# EAGLE design EEZ DIB module template (non-isolated) (EAGLE 7.2.0)
Assembly variants: Farnell, TME
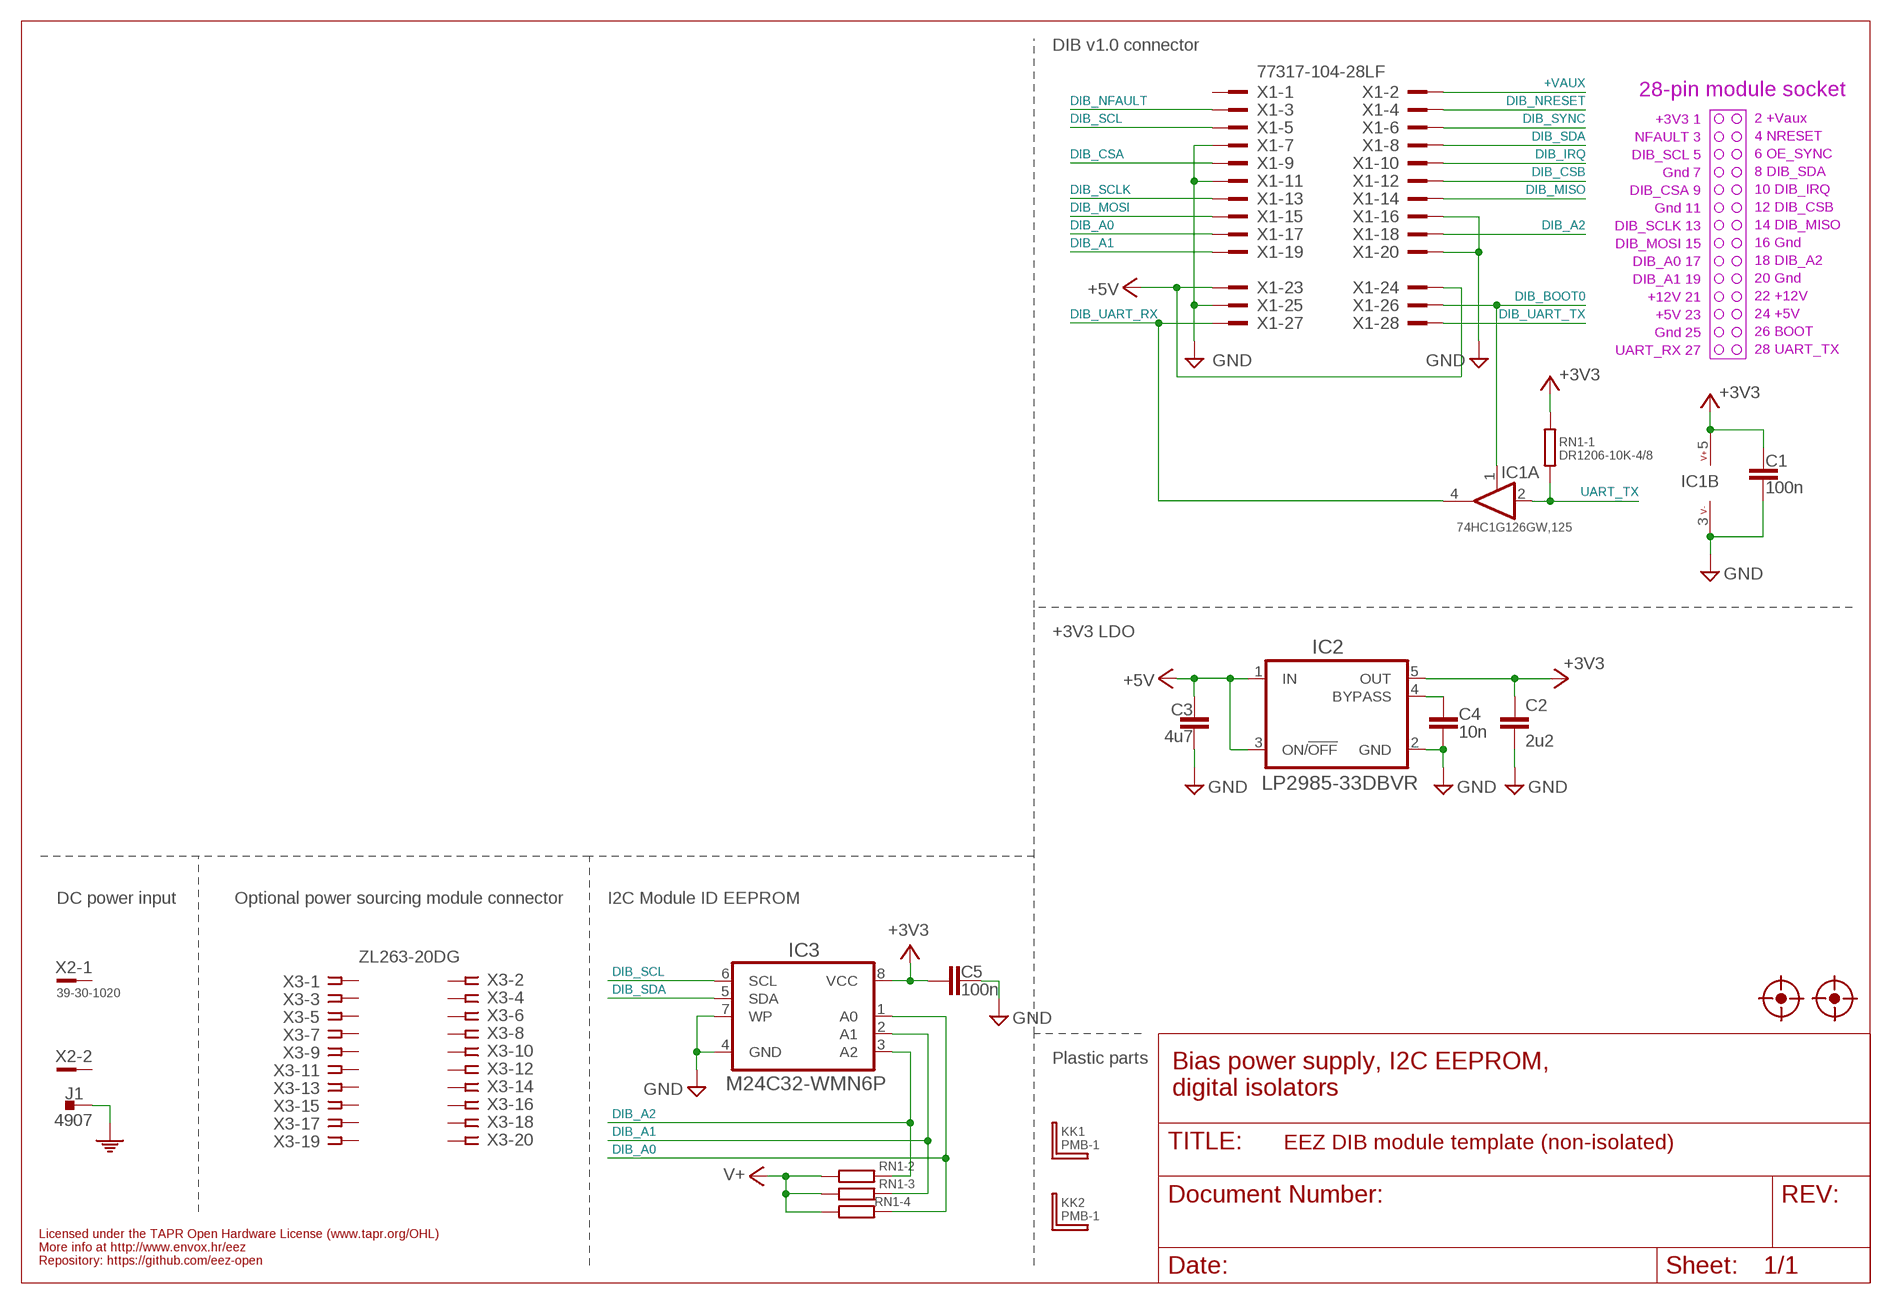
[diagram p0: schematic, sheet 1]

## Parts
C1  100n  C-EUC0603  [C0603]
C2  2u2  C-EUC0805  [C0805]
C3  4u7  C-EUC0805  [C0805]
C4  10n  C-EUC0805  [C0805]
C5  100n  C-EUC0603  [C0603]
FM1  FIDUCIAL_2  [FIDUCIAL_DUAL]
FM2  FIDUCIAL_2  [FIDUCIAL_DUAL]
IC1  74HC1G126GW,125  [SOT65P210X110-5N]
IC2  LP2985-33DBVR  LP2985  [SOT95P270X145-5N]
IC3  M24C32-WMN6P  AT24CXXSOIC8  [SOIC127P600X173-8N]
J1  4907  PCB_TAB-4907  [PCB_TAB-4907]
KK1  PMB-1  PCB-MB  [PCB-MB]
KK2  PMB-1  PCB-MB  [PCB-MB]
RN1  DR1206-10K-4/8  R_ARRAY4  [CAY16]
X1  77317-104-28LF  [77317-104-28LF]
X2  39-30-1020  MINIFIT_39301020  [MINIFIT_39301020]
X3  ZL263-20DG  SSW-110-02-T-D-RA  [SSW-110-02-T-D-RA]

## Nets
+3V3: C1.1 C2.1 C5.2 IC1.5(B:V+) IC2.5(OUT) IC3.8(VCC) RN1.8
+5V: C3.2 IC2.1(IN) IC2.3(ON/!OFF) X1.23 X1.24
+VAUX: X1.2
DIB_A0: IC3.1(A0) RN1.4 X1.17
DIB_A1: IC3.2(A1) RN1.3 X1.19
DIB_A2: IC3.3(A2) RN1.2 X1.18
DIB_BOOT0: IC1.1(A:EN) X1.26
DIB_CSA: X1.9
DIB_CSB: X1.12
DIB_IRQ: X1.10
DIB_MISO: X1.14
DIB_MOSI: X1.15
DIB_NFAULT: X1.3
DIB_NRESET: X1.4
DIB_SCL: IC3.6(SCL) X1.5
DIB_SCLK: X1.13
DIB_SDA: IC3.5(SDA) X1.8
DIB_SYNC: X1.6
DIB_UART_RX: IC1.4(A:O) X1.27
DIB_UART_TX: X1.28
GND: C1.2 C2.2 C3.1 C4.1 C5.1 IC1.3(B:V-) IC2.2(GND) IC3.4(GND) IC3.7(WP) X1.7 X1.11 X1.16 X1.20 X1.25
N$1: C4.2 IC2.4(BYPASS)
PE: J1.1 J1.2
UART_TX: IC1.2(A:I) RN1.1
V+: RN1.5 RN1.6 RN1.7
Unconnected: X1.1 X1.21 X1.22 X2.1 X2.2 X3.1 X3.2 X3.3 X3.4 X3.5 X3.6 X3.7 X3.8 X3.9 X3.10 X3.11 X3.12 X3.13 X3.14 X3.15 X3.16 X3.17 X3.18 X3.19 X3.20

## Notes on the sheet
- DIB v1.0 connector
- 28-pin module socket
- +3V3 1
- 2 +Vaux
- NFAULT 3
- 4 NRESET
- DIB_SCL 5
- 6 OE_SYNC
- Gnd 7
- 8 DIB_SDA
- DIB_CSA 9
- 10 DIB_IRQ
- Gnd 11
- 12 DIB_CSB
- DIB_SCLK 13
- 14 DIB_MISO
- DIB_MOSI 15
- 16 Gnd
- DIB_A0 17
- 18 DIB_A2
- DIB_A1 19
- 20 Gnd
- +12V 21
- 22 +12V
- +5V 23
- 24 +5V
- Gnd 25
- 26 BOOT
- UART_RX 27
- 28 UART_TX
- +3V3 LDO
- DC power input | Optional power sourcing module connector | I2C Module ID EEPROM
- Plastic parts
- Bias power supply, I2C EEPROM,
  digital isolators
- Licensed under the TAPR Open Hardware License (www.tapr.org/OHL)
- More info at http://www.envox.hr/eez
- Repository: https://github.com/eez-open

## Library data of the parts
C1-C5 = rcl:C-EU: CAPACITOR, European symbol
FM1 FM2 = EEZ_Lib1:FIDUCIAL: Fiducial mark for pick and place automation
IC1 = EEZ_Lib1:74HC1G126: Single Bus Buffer Gate With 3-State Outputs
IC2 = EEZ_DIB:LP2985: 150-mA Low-noise Low-dropout Regulator With Shutdown
IC3 = EEZ_Lib1:AT24CXX: I2C-Compatible (2-wire) Serial EEPROM
J1 = EEZ_connectors:PCB_TAB: PCB quick-fit terminal
KK1 KK2 = EEZ_Lib1:PCB-MB: Richo Mounting Block; 16 x 6 mm
RN1 = EEZ_Lib1:R_ARRAY4: 1206 four resistor array
X1 = EEZ_connectors:77317-104-28LF: Headers & Wire Housings 28P right angle 0.1" pitch
X2 = EEZ_connectors:MINIFIT_39301020: Molex Socket; wire-board; male; Mini-Fit Jr; 4.2mm; PIN:2; THT; PCB snap
X3 = EEZ_connectors:SSW-110-02-T-D-RA: Samtec SSW-113-02-T-D-RA Receptacle, 2.54MM, RA, 20-way

## Net classes
0 default: width 0.203 mm, drill 0.3 mm, clearance 0.203 mm
1 lvds: width 0.152 mm, drill 0.3 mm, clearance 0.152 mm to class 0, clearance 0.152 mm
2 gnd: width 0.254 mm, drill 0.584 mm, clearance 0.254 mm

## Board
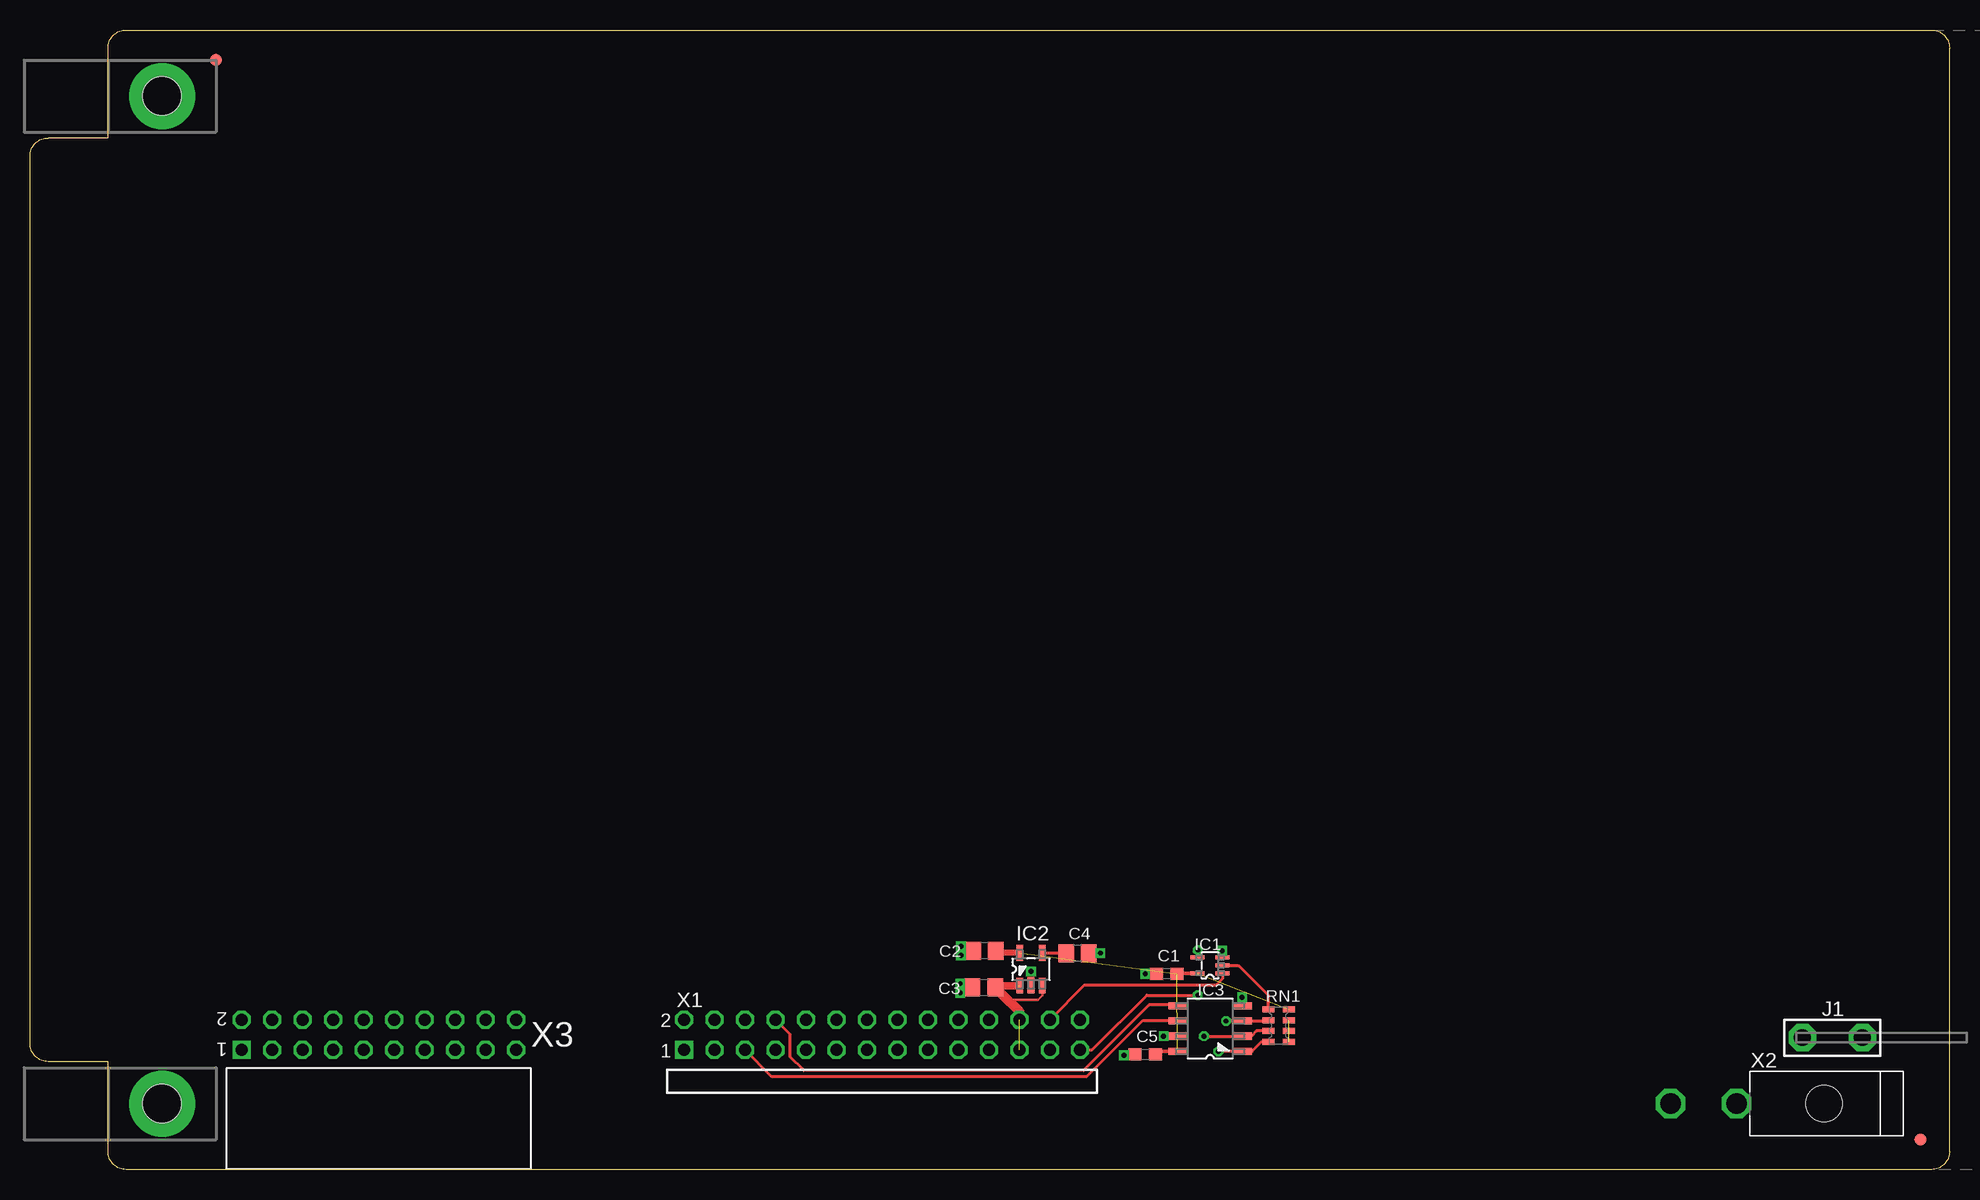
[diagram p1: board, top side]
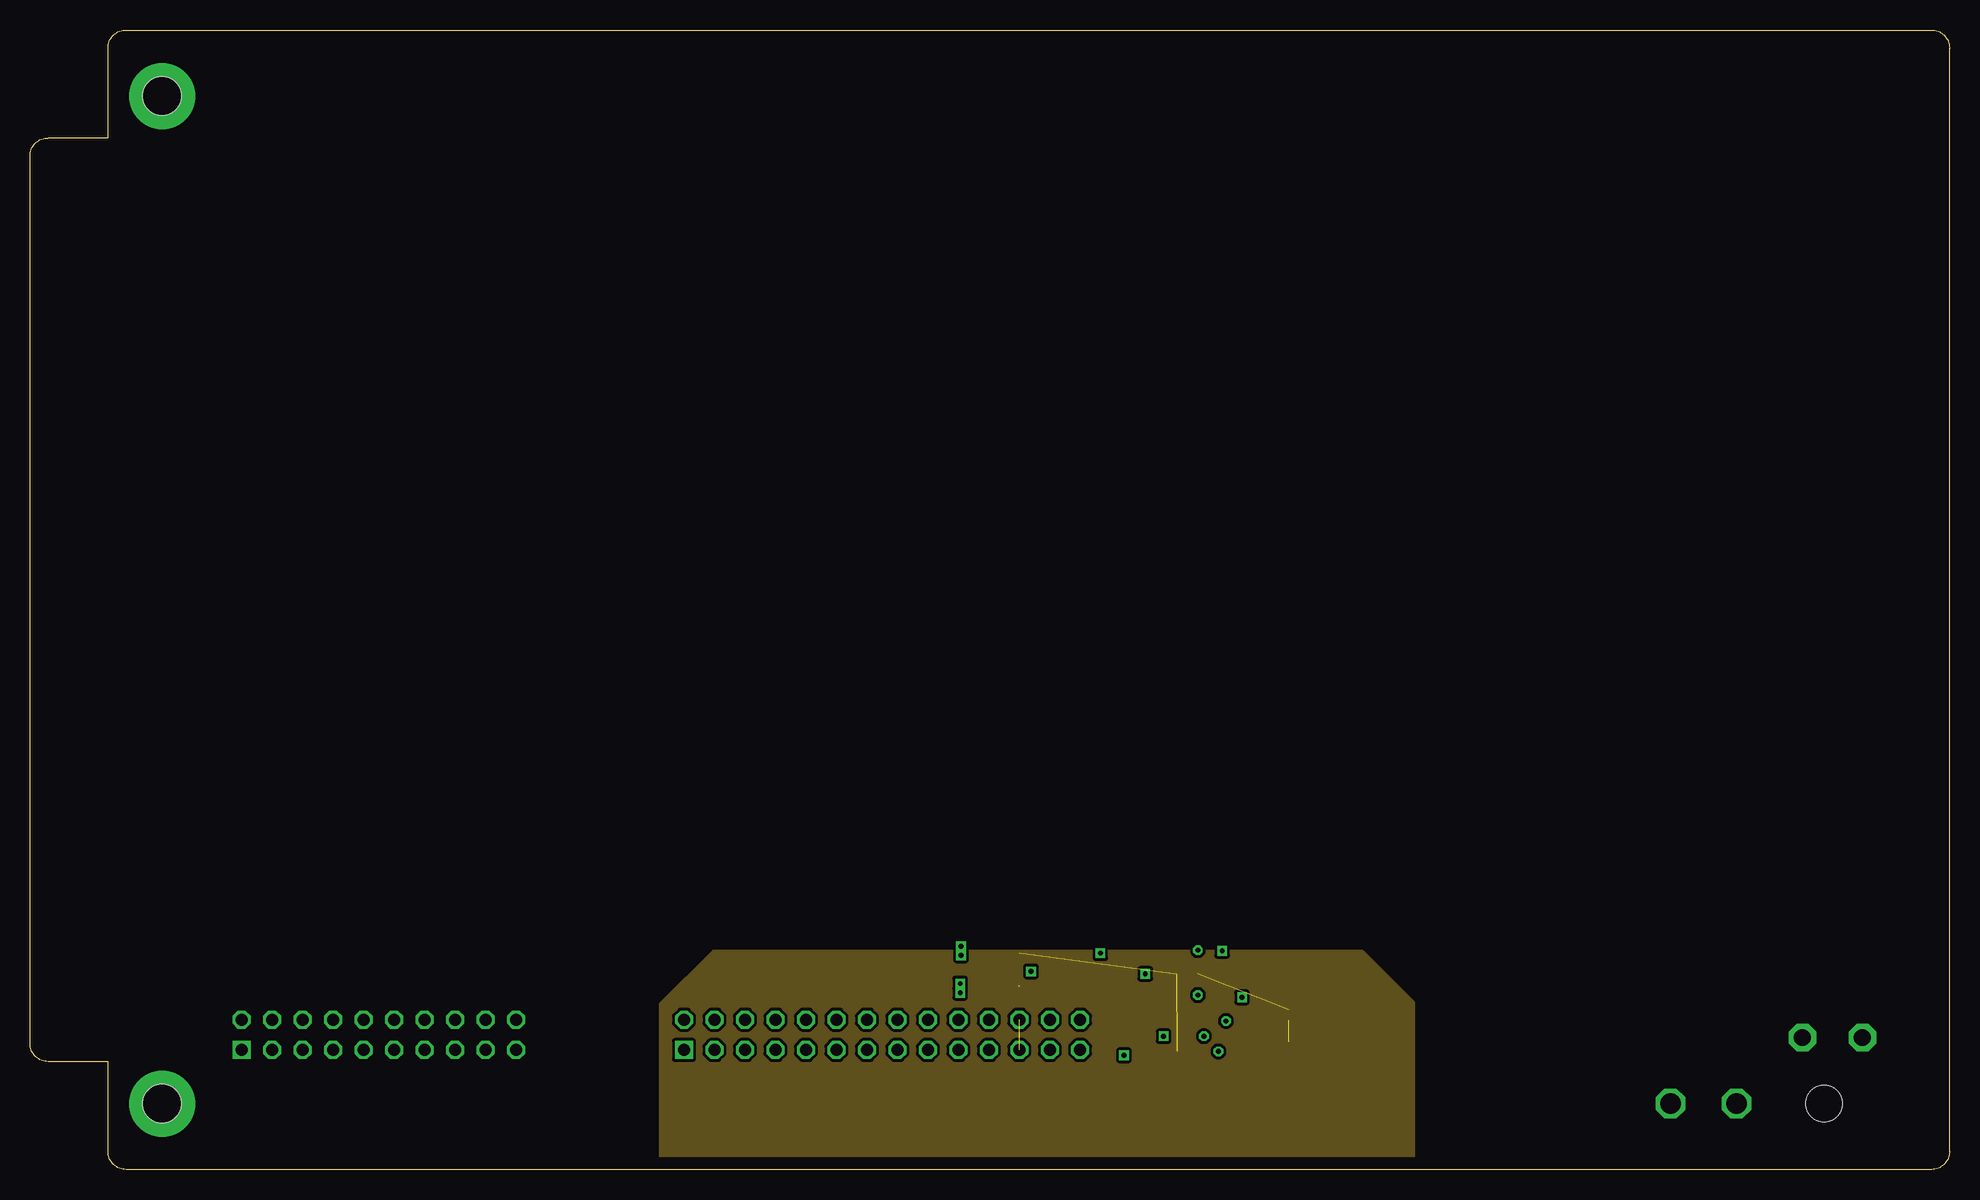
[diagram p2: board, inner layer L2]
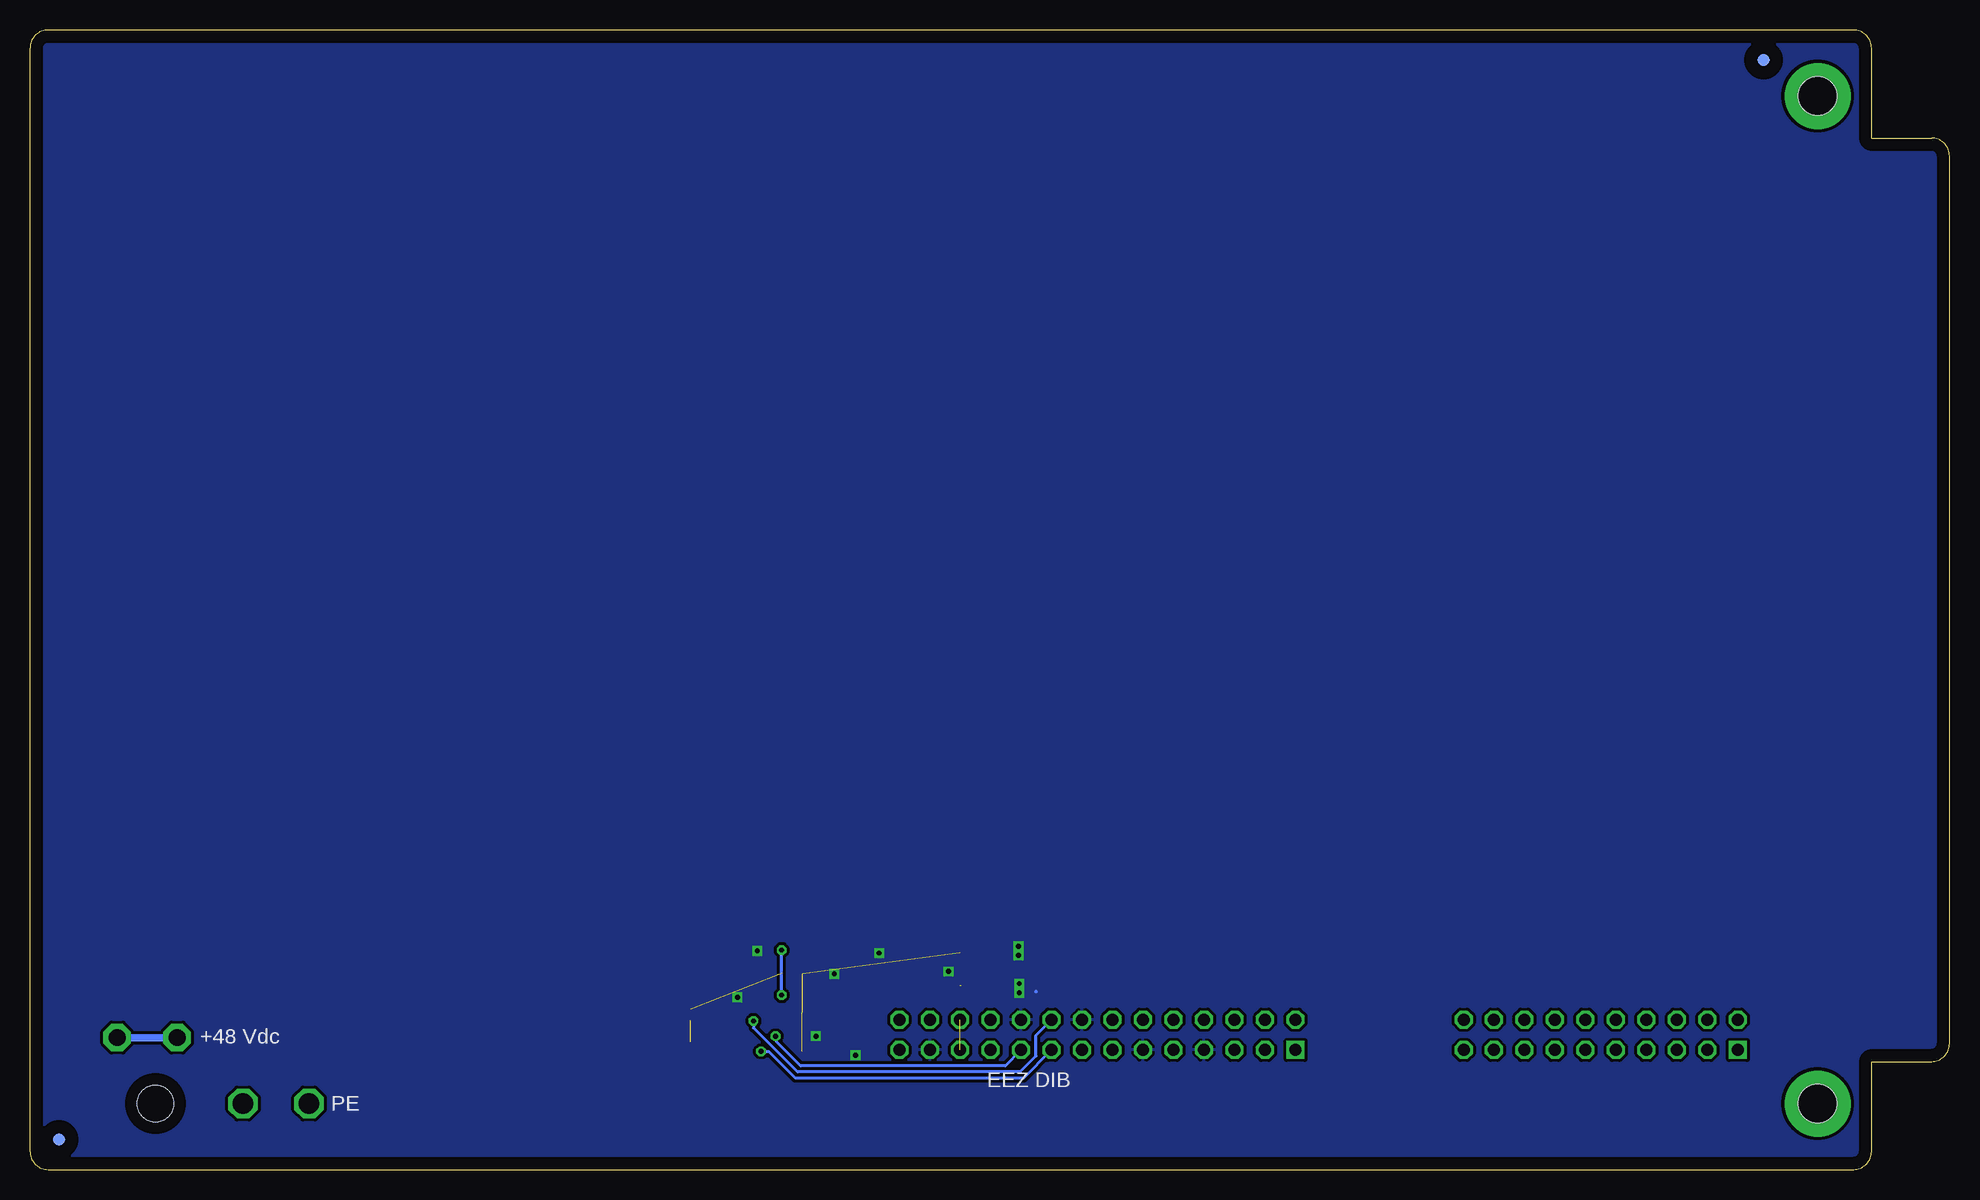
[diagram p3: board, bottom side, seen from below]

Size 160 x 95 mm. Coordinates in mm from the lower left corner, seen from the top.
Outline: 8,95 158.5,95 arc-90 160,93.5 160,1.5 arc-90 158.5,0 8,0 arc-90 6.5,1.5 6.5,9 1.5,9 arc-90 0,10.5 0,84.5 arc-90 1.5,86 6.5,86 6.5,93.5 arc-90 8,95
Copper layers (1+2+15+16): Top 0.035mm / dielectric 7mil / L2 0.03mm / dielectric 44mil / L3 0.03mm / dielectric 7mil / Bottom 0.035mm
Design rules "default *": minimum track width 6mil, minimum drill 0.3mm, track to track 6mil, track to pad 6mil, pad to pad 6mil, via to via 6mil, smd to smd 6mil, copper to edge 40mil, drill to drill 8mil, minimum pad ring 4mil, minimum via ring 8mil, stop-mask expansion 2.5mil, vias tented up to drill 1mm, thermal gap 8mil
vRestrict: area 53,0 to 128,8.5

### Footprints (pad centres in the part's own frame; a part is rotated, then mirrored left to right if it is on the bottom)
C0603 = smd 1.1 x 1: 1 -0.85,0; 2 0.85,0
C0805 = smd 1.3 x 1.5: 1 -0.95,0; 2 0.95,0
FIDUCIAL_DUAL = smd 1.016 x 1.016 bottom: B 0,0 | smd 1.016 x 1.016: T 0,0
SOT65P210X110-5N = smd 1.168 x 0.356: 1 -1.041,0.66; 2 -1.041,0; 3 -1.041,-0.66; 4 1.041,-0.66; 5 1.041,0.66
SOT95P270X145-5N = smd 1.321 x 0.559: 1 -1.372,0.94; 2 -1.372,0; 3 -1.372,-0.94; 4 1.372,-0.94; 5 1.372,0.94
SOIC127P600X173-8N = smd 1.55 x 0.6: 1 -2.7,1.9; 2 -2.7,0.63; 3 -2.7,-0.64; 4 -2.7,-1.91; 5 2.7,-1.91; 6 2.7,-0.64; 7 2.7,0.63; 8 2.7,1.9
PCB_TAB-4907 = drill 1.4 pad 2.3 octagon: 1 -2.5,0; 2 2.5,0
PCB-MB = hole 3.2: 0,0
CAY16 = smd 0.5 x 1: 1 -1.35,-0.85; 2 -0.45,-0.85; 3 0.45,-0.85; 4 1.35,-0.85; 5 1.35,0.85; 6 0.45,0.85; 7 -0.45,0.85; 8 -1.35,0.85
77317-104-28LF = drill 1 pad 1.5 square: 1 -33.02,-2.54 | drill 1 pad 1.5 octagon: 2 -33.02,0; 3 -30.48,-2.54; 4 -30.48,0; 5 -27.94,-2.54; 6 -27.94,0; 7 -25.4,-2.54; 8 -25.4,0; 9 -22.86,-2.54; 10 -22.86,0; 11 -20.32,-2.54; 12 -20.32,0; 13 -17.78,-2.54; 14 -17.78,0; 15 -15.24,-2.54; 16 -15.24,0; 17 -12.7,-2.54; 18 -12.7,0; 19 -10.16,-2.54; 20 -10.16,0; 21 -7.62,-2.54; 22 -7.62,0; 23 -5.08,-2.54; 24 -5.08,0; 25 -2.54,-2.54; 26 -2.54,0; 27 0,-2.54; 28 0,0
MINIFIT_39301020 = drill 1.7 octagon: 1 0,0; 2 0,5.5 | hole 3: 0,-7.3
SSW-110-02-T-D-RA = drill 1 pad 1.5 square: 1 22.86,2.54 | drill 1 pad 1.5 octagon: 2 22.86,0; 3 20.32,2.54; 4 20.32,0; 5 17.78,2.54; 6 17.78,0; 7 15.24,2.54; 8 15.24,0; 9 12.7,2.54; 10 12.7,0; 11 10.16,2.54; 12 10.16,0; 13 7.62,2.54; 14 7.62,0; 15 5.08,2.54; 16 5.08,0; 17 2.54,2.54; 18 2.54,0; 19 0,2.54; 20 0,0

### Placement (x,y rotation side)
C1  94.74,16.32 180 top
C2  79.57,18.22 180 top
C3  79.5,15.18 0 top
C4  87.31,18.03 180 top
C5  92.96,9.59 0 top
FM1  15.5,92.5 0 top
FM2  157.58,2.5 0 top
IC1  98.36,17.02 180 top
IC2  83.44,16.7 90 top
IC3  98.36,11.75 180 top
J1  150.24,11 180 top
KK1  11,89.5 0 top
KK2  11,5.5 0 top
RN1  104.08,12 270 top
X1  87.54,12.5 0 top
X2  142.24,5.5 90 top
X3  40.5,12.5 180 top

### Tracks (layer width: path | path; a pad name or v marks a point on that pad's centre or on a via)
+3V3  (3 unrouted)
  Top 0.305: IC3.8 93.88,9.85 C5.2 | IC1.5 95.63,16.36 C1.1
  Top 0.508: IC2.5 80.67,18.07 C2.1
+5V  (2 unrouted)
  Top 0.203: IC2.3 84.38,14.53 84.01,14.16 81.47,14.16 81.09,14.54
  Top 0.508: 80.6,15.33 C3.2
  Top 0.61: 80.6,15.33 82.4,15.33
  Top 0.813: X1.24 82.46,13.17 81.09,14.54 C3.2
DIB_A0  (via drill 0.4)
  Top 0.254: v99.06,9.84 IC3.1 101.86,9.85 102.66,10.65 RN1.4
  Bottom 0.254: X1.17 77.18,7.62 96.2,7.62 98.42,9.84 v99.06,9.84
DIB_A1  (via drill 0.4)
  Top 0.254: v97.85,11.11 IC3.2 101.8,11.12 102.23,11.55 RN1.3
  Bottom 0.254: X1.19 78.7,8.64 95.76,8.64 97.85,10.73 v97.85,11.11
DIB_A2  (via drill 0.4)
  Top 0.254: IC3.3 | IC3.3 v99.7,12.39 v99.69,12.38 | IC3.3 103.16,12.39 RN1.2
  Bottom 0.254: X1.18 76.14,11.2 76.14,9.46 77.47,8.13 96.01,8.13 99.69,11.81 v99.69,12.38
DIB_BOOT0
  Top 0.254: IC1.1 99.4,15.9 98.87,15.37 87.87,15.37 X1.26
DIB_SCL
  Top 0.203: IC3.6 96.27,12.39
  Top 0.254: IC3.6 92.71,12.38 88.08,7.75 61.81,7.75 X1.5
DIB_SDA
  Top 0.254: IC3.5 95.6,13.72 93.28,13.72 87.82,8.26 64.52,8.26 63.37,9.4 63.37,11.27 X1.8
DIB_UART_RX  (via drill 0.4)
  Top 0.254: X1.27 88.51,9.96 93.09,14.54 v97.35,14.54 | v97.35,18.29 97.35,17.7 IC1.4
  Bottom 0.254: v97.35,14.54 v97.35,18.29
GND  (via drill 0.4)
  Top 0.203: C2.2 77.98,18.22 v77.6,18.61 | C3.1 77.85,15.18 v77.53,15.49
  Top 0.254: v101.03,14.35 101.03,13.69 IC3.4 | C4.1 v89.22,18.03 | C5.1 v91.19,9.53 | IC3.7 v94.49,11.12 v94.49,11.11
  Top 0.305: v92.96,16.32 C1.2 | IC1.3 99.4,18.2 v99.38,18.22
  Top 0.61: v83.44,16.51 IC2.2
  Bottom 0.305: 76.14,14.8 76.14,14.86
  other vias: 77.53,14.73 77.6,17.84
  pour L2 (isolate 0.305, rank 2): -0.13,95 160.53,95 160.53,0 118.05,0 118.05,13.91 111.82,20.13 55.63,20.13 44.39,8.89 44.39,0.25 0.19,-0.19
  pour Bottom (isolate 0.254, rank 2): -0.13,94.74 160.02,94.74 160.02,0 0,-0.25
GNDIO
  pour L2 (isolate 0.254): 52.58,0.44 52.58,13.84 56.96,18.22 111.06,18.22 115.32,13.97 115.32,0.44
HOLE_DL  (via drill 3.2 pad 5.5)
  other vias: 11,5.5
HOLE_UL  (via drill 3.2 pad 5.5)
  other vias: 11,89.5
N$1
  Top 0.254: IC2.4 86.32,18.07 C4.2
PE
  Bottom 0.61: J1.1 J1.2
UART_TX
  Top 0.254: IC1.2 100.71,17.02 103.23,14.5 RN1.1
V+  (2 unrouted)

### Text on the board
bPlace: +48 Vdc | EEZ DIB | PE
tDocu: Max. module width / (for EEZ BB3 chassis!)